# EasyEDA Pro project 单片机最小系统板.eprj

# Schematic Schematic1
Board Name: Board1; Create Date: 2024-09-29; Page Name: P1; Project Name: 单片机最小系统板; Schematic Name: Schematic1; Update Date: 2024-10-05; Company: 嘉立创EDA; Page Size: A4; Version: V1.0
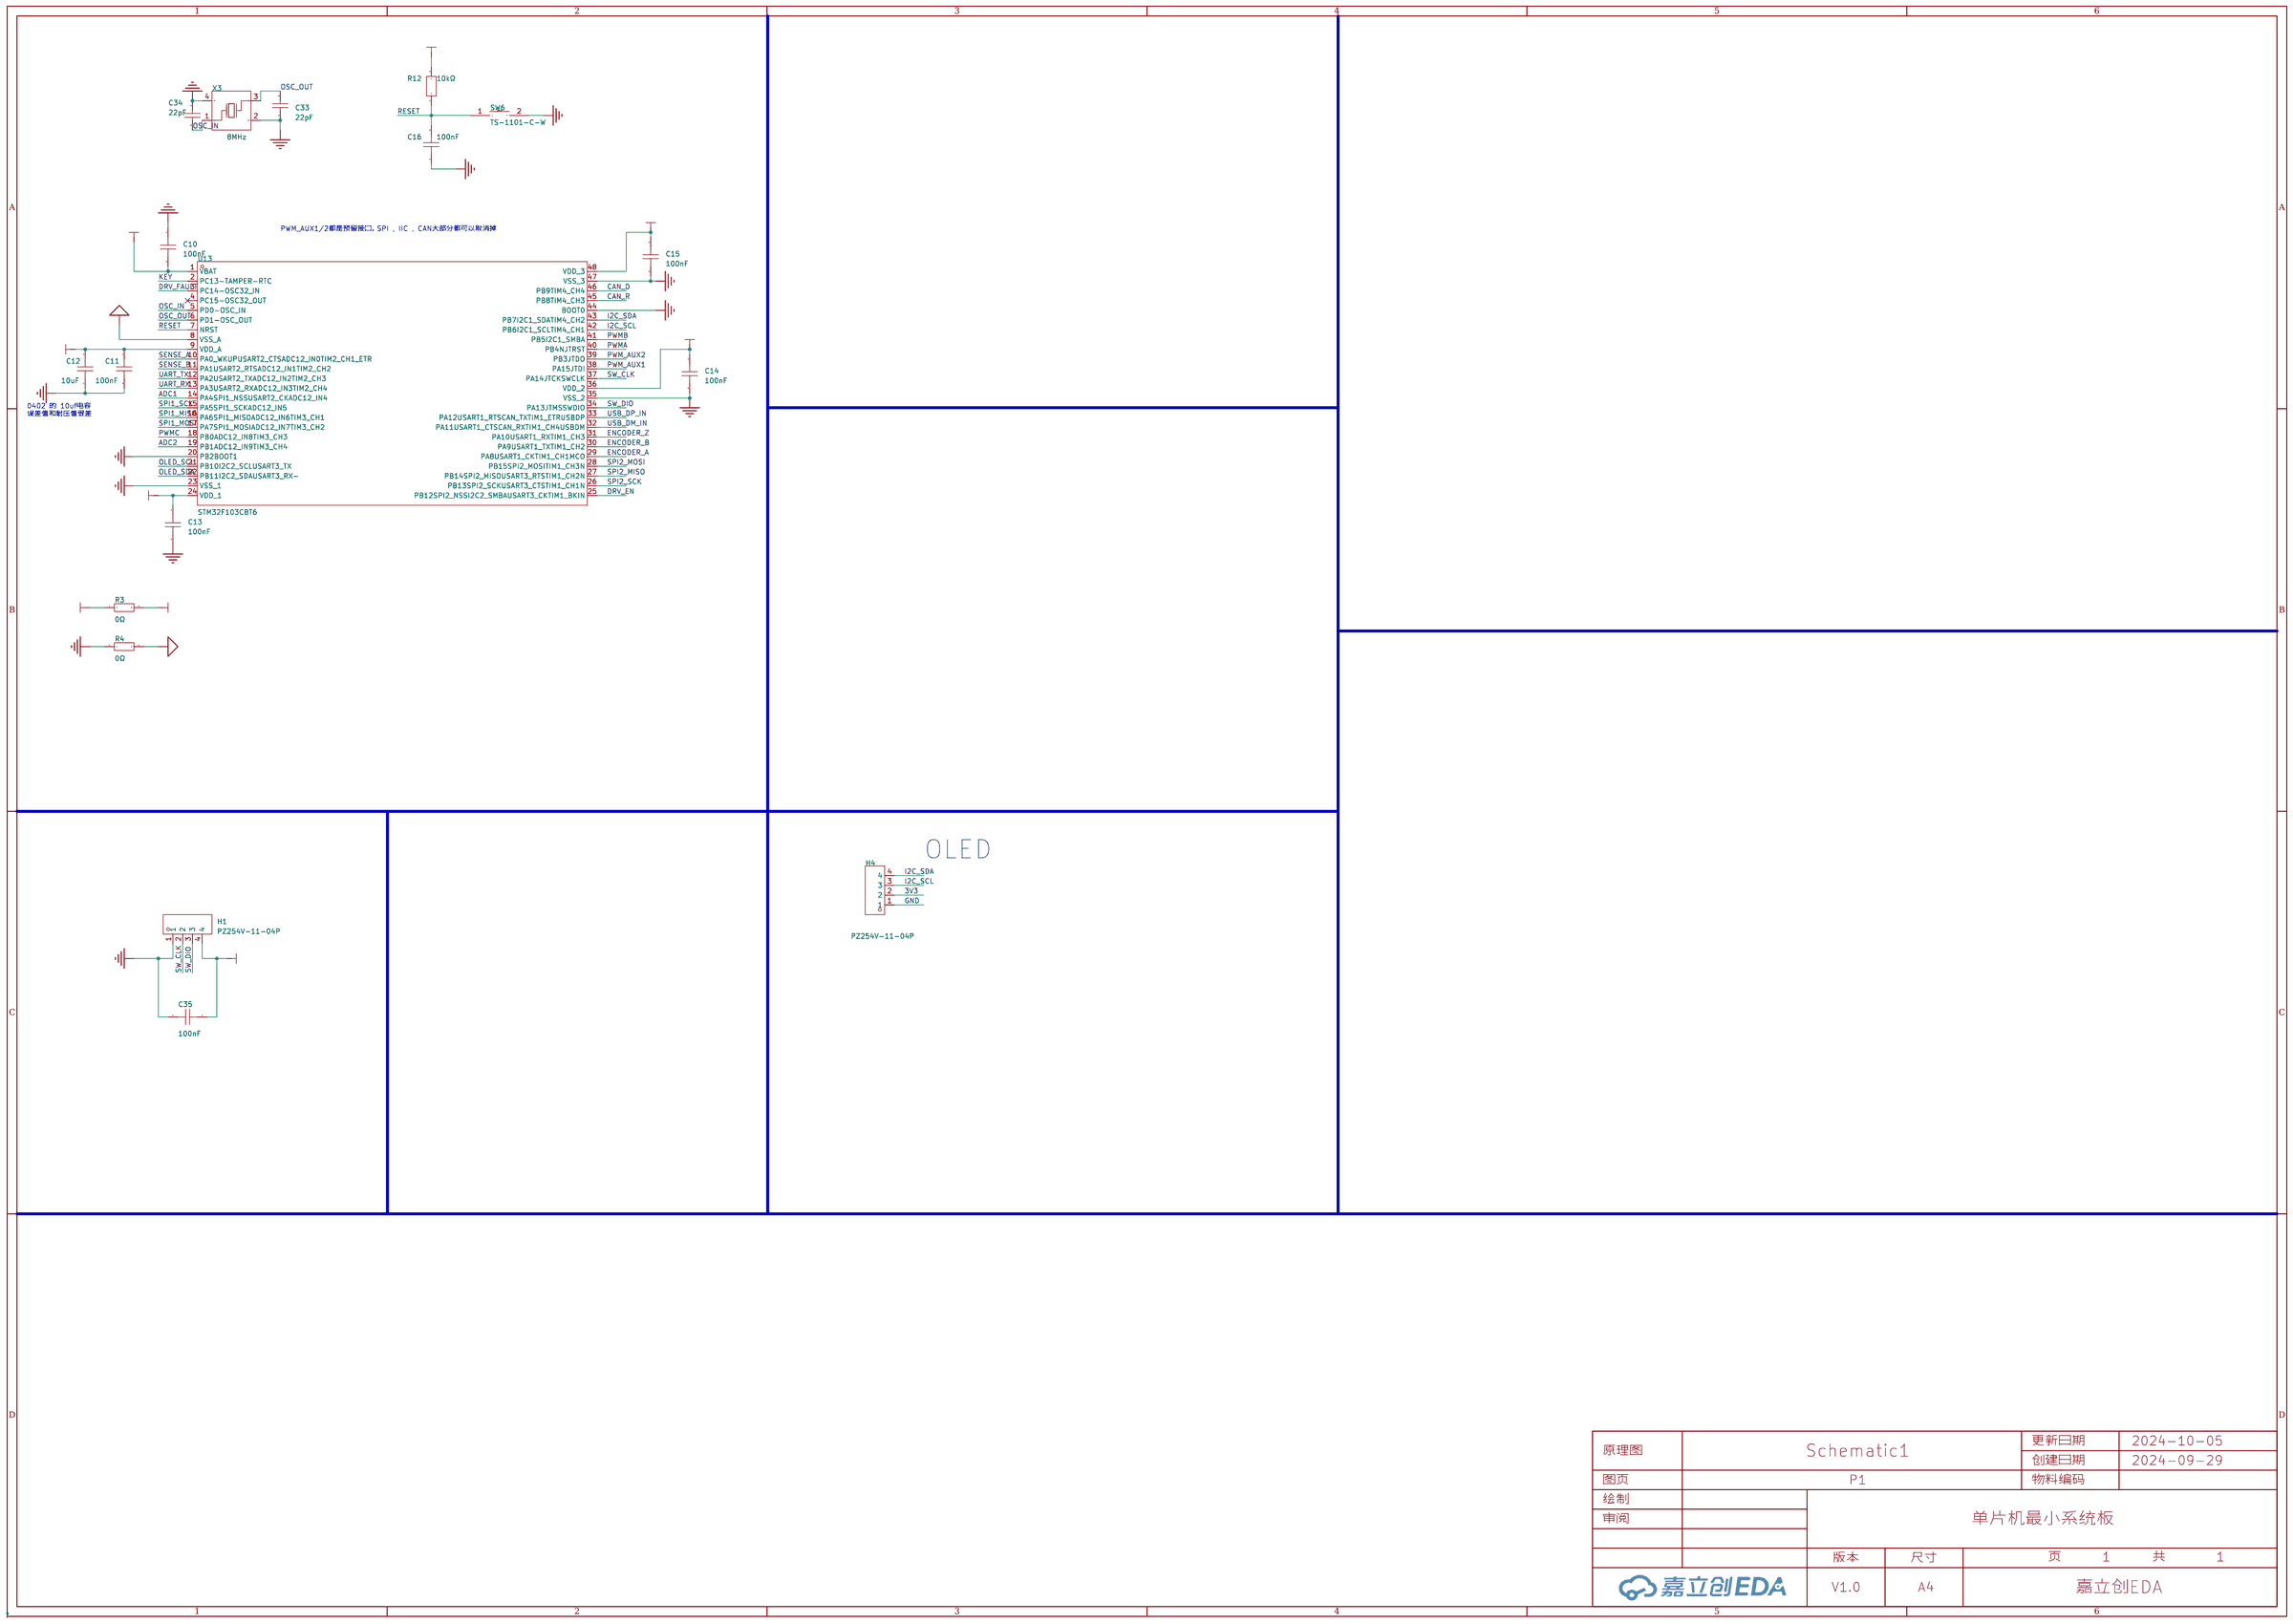
[diagram p0: schematic sheet]

## Parts
C10  100nF  [C0603]
C11  100nF  [C0603]
C12  10uF  [C0603]
C13  100nF  [C0603]
C14  100nF  [C0603]
C15  100nF  [C0603]
C16  100nF  [C0603]
C33  22pF  [C0603]
C34  22pF  [C0603]
C35  100nF  [C0603]
H1  PZ254V-11-04P  [HDR-TH_4P-P2.54-V-M]
H4  PZ254V-11-04P  [HDR-TH_4P-P2.54-V-M]
R3  0Ω  [R0603]
R4  0Ω  [R0603]
R12  10kΩ  [R0603]
SW6  TS-1101-C-W  [SW-SMD_L6.0-W3.3-LS8.0]
U13  STM32F103CBT6  [LQFP-48_L7.0-W7.0-P0.50-LS9.0-BL]
X3  8MHz  [OSC-SMD_4P-L3.2-W2.5-BL]

## Library data of the parts
C10 C11 C13-C16 C35 = CGA0603X7R104K500JT: 容值:100nF;精度:±10%;额定电压:50V;材质(温度系数):X7R;; LCSC Part Name: 100nF ±10% 50V; Supplier Part: C6119867; Manufacturer: HRE(芯声); Supplier Footprint: 0603; JLCPCB Part Class: 扩展库; Supplier: LCSC; Tolerance: ±10%; Voltage Rated: 50V; Temperature Coefficient: X7R
C12 = GRM188R6YA106MA73D: 容值:10uF;精度:±20%;额定电压:35V;材质(温度系数):X5R;; LCSC Part Name: 10uF ±20% 35V; Supplier Part: C194427; Manufacturer: muRata(村田); Supplier Footprint: 0603; JLCPCB Part Class: 扩展库; Datasheet: https://atta.szlcsc.com/upload/public/pdf/source/20210128/C194427_FCA3640823207DDB58700A82F1A19B5F.pdf; Supplier: LCSC; Tolerance: ±20%; Voltage Rated: 35V; Temperature Coefficient: X5R
C33 C34 = CL10C220JB8NNNC: 容值:22pF;精度:±5%;额定电压:50V;材质(温度系数):C0G;; LCSC Part Name: 22pF ±5% 50V; Supplier Part: C1653; Manufacturer: SAMSUNG(三星); Supplier Footprint: 0603; JLCPCB Part Class: 基础库; Datasheet: https://atta.szlcsc.com/upload/public/pdf/source/20160218/1457707763339.pdf; Supplier: LCSC; Tolerance: ±5%; Voltage Rated: 50V; Temperature Coefficient: C0G
H1 H4 = PZ254V-11-04P: 插针结构:1x4P;间距:2.54mm;行距:-;圆针/方针:方针;安装类型:直插;排数:单排;总PIN位数:4P;额定电流:3A;额定电压:250V;配合针长度:6mm;塑高:2.5mm;端接针长度:3mm;触头材质:-;工作温度范围:-40℃~+105℃;颜色:黑色;; LCSC Part Name: 间距:2.54mm 1x4P 直插 方针; Supplier Part: C2691448; Manufacturer: XFCN(兴飞); Supplier Footprint: 插件,P=2.54mm; JLCPCB Part Class: 扩展库; Datasheet: https://atta.szlcsc.com/upload/public/pdf/source/20200309/C492403_F9F19131791D08044AD4F84F8E751A34.pdf; Supplier: LCSC; Pin Structure: 1x4P; Pitch: 2.54mm; Circluar Pins/Square Pins: 方针; Mounting Type: 直插; Number of Rows: 单排; Number of Pins: 4P; Current Rating (Max): 3A; Voltage Rating (Max): 250V; Length of Mating Pin: 6mm; Insulation Height: 2.5mm; Length of End Connection Pin: 3mm; Operating Temperature Range: -40℃~+105℃; Color: 黑色
R3 R4 = 0603WAF0000T5E: 电阻类型:厚膜电阻;阻值:0Ω;精度:±1%;功率:100mW;最大工作电压:75V;; LCSC Part Name: 0Ω ±1% 100mW 厚膜电阻; Supplier Part: C21189; Manufacturer: UNI-ROYAL(厚声); Supplier Footprint: 0603; JLCPCB Part Class: 基础库; Datasheet: https://atta.szlcsc.com/upload/public/pdf/source/20200306/C422600_1E6D84923E4A46A82E41ADD87F860B5C.pdf; Supplier: LCSC; Type: 厚膜电阻; Tolerance: ±1%; Power(Watts): 100mW; Overload Voltage (Max): 75V; Operating Temperature Range: -55℃~+155℃
R12 = FRC0603J103TS: 电阻类型:厚膜电阻;阻值:10kΩ;精度:±5%;功率:100mW;最大工作电压:75V;温度系数:±100ppm/℃;; LCSC Part Name: 10kΩ ±5% 100mW 厚膜电阻; Supplier Part: C2930027; Manufacturer: FOJAN(富捷); Supplier Footprint: 0603; JLCPCB Part Class: 扩展库; Datasheet: https://atta.szlcsc.com/upload/public/pdf/source/20211221/925EC7D7225764EE0046F22065062C87.pdf; Supplier: LCSC; Type: 厚膜电阻; Tolerance: ±5%; Power(Watts): 100mW; Overload Voltage (Max): 75V; Temperature Coefficient: ±100ppm/℃; Operating Temperature Range: -55℃~+155℃
SW6 = TS-1101-C-W: 电路结构:单刀单掷;按钮形状:矩形按钮;作用力:260gf;安装方式:立贴;开关长度:6mm;开关宽度:3.6mm;开关高度:2.5mm;带支架:不带;触点电流:50mA;额定电压(AC):-;额定电压(DC):12V;额定功率:-;绝缘电阻:-;带灯:无;机械寿命:5万次;; LCSC Part Name: 6*3.6*2.5mm 立贴 轻触开关; Supplier Part: C318938; Manufacturer: XKB Connectivity(中国星坤); Supplier Footprint: SMD; JLCPCB Part Class: 扩展库; Datasheet: https://atta.szlcsc.com/upload/public/pdf/source/20200227/C318938_C2E53B1EEDE37D980A33616AC086DE53.pdf; Supplier: LCSC; Circuit: 单刀单掷; Actuator Style: 矩形按钮; Operating Force: 260gf; Mounting Style: 立贴; Switch Length: 6mm; Switch Width: 3.6mm; Switch Height: 2.5mm; Strike Gundam: 不带; Contact Current: 50mA; Voltage Rating (DC): 12V; Actuator/Cap Color: 白色带淡绿; With Lamp: 无; Mechanical Life: 5万次; Operating Temperature: -30℃~+85℃
U13 = STM32F103CBT6: CPU内核:ARM-M3;程序存储容量:128KB;RAM总容量:20KB;GPIO端口数量:37;工作电压范围:2V~3.6V;CPU最大主频:72MHz;程序存储器类型:FLASH;; LCSC Part Name: 主流增强型ARM Cortex-M3 MCU，具有128 KB Flash、72 MHz CPU、电机控制、USB和CAN; Supplier Part: C8304; Manufacturer: ST(意法半导体); Supplier Footprint: LQFP-48(7x7); JLCPCB Part Class: 扩展库; Datasheet: https://atta.szlcsc.com/upload/public/pdf/source/20150811/1457707344439.pdf; Supplier: LCSC; CPU Core: ARM-M3; Program Storage Size: 128KB; RAM Size: 20KB; GPIO Ports Number: 37; Operating Voltage Range: 2V~3.6V; CPU Maximum Speed: 72MHz; Program Memory Type: FLASH; Operating Temperature Range: -40℃~+85℃; ADC (Bit): 12bit; Universal Serial Bus: 有; Peripheral/Function: DMA；温度传感器；PWM; Watchdog: 有; Infrared Data Association: 有; Low-Voltage Detect: 有; Direct Memory Access: 有; Internal Oscillator: 有
X3 = TAXM8M4RFDCET2T: 晶振类型:贴片晶振;频率:8MHz;常温频差:±20ppm;外接负载电容:12pF;频率稳定度(全温):±20ppm;; LCSC Part Name: 8MHz ±20ppm 12pF; Supplier Part: C403948; Manufacturer: YJX(雅晶鑫); Supplier Footprint: SMD3225-4P; JLCPCB Part Class: 扩展库; Datasheet: https://atta.szlcsc.com/upload/public/pdf/source/20190712/C403948_DCE244DEF035C9ADCC7C08191B17B6F0.pdf; Supplier: LCSC; Crystal Type: 贴片晶振; Normal temperature Frequency Tolerance: ±20ppm; External load capacitor: 12pF; Frequency Stability(Full temperature range): ±20ppm; Equivalent Series Resistance (ESR): 250Ω; Operating Temperature: -40℃~+85℃

## Nets
3V3: C10.2 C13.1 C14.1 C15.1 C35.2 H1.4 H4.2 R3.1 R12.2 U13.1(VBAT) U13.24(VDD_1) U13.36(VDD_2) U13.48(VDD_3)
AGND: R4.2 U13.8(VSS_A)
AVCC: C11.1 C12.2 R3.2 U13.9(VDD_A)
GND: C10.1 C11.2 C12.1 C13.2 C14.2 C15.2 C16.1 C33.1 C34.1 C35.1 H1.1 H4.1 R4.1 SW6.2 U13.20(PB2BOOT1) U13.23(VSS_1) U13.35(VSS_2) U13.44(BOOT0) U13.47(VSS_3) X3.2(GND) X3.4(GND)
ADC1: U13.14(PA4SPI1_NSSUSART2_CKADC12_IN4)
ADC2: U13.19(PB1ADC12_IN9TIM3_CH4)
CAN_D: U13.46(PB9TIM4_CH4)
CAN_R: U13.45(PB8TIM4_CH3)
DRV_EN: U13.25(PB12SPI2_NSSI2C2_SMBAUSART3_CKTIM1_BKIN)
DRV_FAULT: U13.3(PC14-OSC32_IN)
ENCODER_A: U13.29(PA8USART1_CKTIM1_CH1MCO)
ENCODER_B: U13.30(PA9USART1_TXTIM1_CH2)
ENCODER_Z: U13.31(PA10USART1_RXTIM1_CH3)
I2C_SCL: H4.3 U13.42(PB6I2C1_SCLTIM4_CH1)
I2C_SDA: H4.4 U13.43(PB7I2C1_SDATIM4_CH2)
KEY: U13.2(PC13-TAMPER-RTC)
OLED_SCL: U13.21(PB10I2C2_SCLUSART3_TX)
OLED_SDA: U13.22(PB11I2C2_SDAUSART3_RX-)
OSC_IN: C34.2 U13.5(PD0-OSC_IN) X3.1(OSC1)
OSC_OUT: C33.2 U13.6(PD1-OSC_OUT) X3.3(OSC2)
PWM_AUX1: U13.38(PA15JTDI)
PWM_AUX2: U13.39(PB3JTDO)
PWMA: U13.40(PB4NJTRST)
PWMB: U13.41(PB5I2C1_SMBA)
PWMC: U13.18(PB0ADC12_IN8TIM3_CH3)
RESET: C16.2 R12.1 SW6.1 U13.7(NRST)
SENSE_A: U13.10(PA0_WKUPUSART2_CTSADC12_IN0TIM2_CH1_ETR)
SENSE_B: U13.11(PA1USART2_RTSADC12_IN1TIM2_CH2)
SPI1_MISO: U13.16(PA6SPI1_MISOADC12_IN6TIM3_CH1)
SPI1_MOSI: U13.17(PA7SPI1_MOSIADC12_IN7TIM3_CH2)
SPI1_SCK: U13.15(PA5SPI1_SCKADC12_IN5)
SPI2_MISO: U13.27(PB14SPI2_MISOUSART3_RTSTIM1_CH2N)
SPI2_MOSI: U13.28(PB15SPI2_MOSITIM1_CH3N)
SPI2_SCK: U13.26(PB13SPI2_SCKUSART3_CTSTIM1_CH1N)
SW_CLK: H1.2 U13.37(PA14JTCKSWCLK)
SW_DIO: H1.3 U13.34(PA13JTMSSWDIO)
UART_RX: U13.13(PA3USART2_RXADC12_IN3TIM2_CH4)
UART_TX: U13.12(PA2USART2_TXADC12_IN2TIM2_CH3)
USB_DM_IN: U13.32(PA11USART1_CTSCAN_RXTIM1_CH4USBDM)
USB_DP_IN: U13.33(PA12USART1_RTSCAN_TXTIM1_ETRUSBDP)

Not connected (* = marked no-connect by the designer): U13 4(PC15-OSC32_OUT)*

## Notes on the sheet
- PWM_AUX1/2都是预留接口，SPI , IIC , CAN大部分都可以取消掉
- 0402 的 10uf电容
  误差值和耐压值很差
- OLED

# Board PCB1
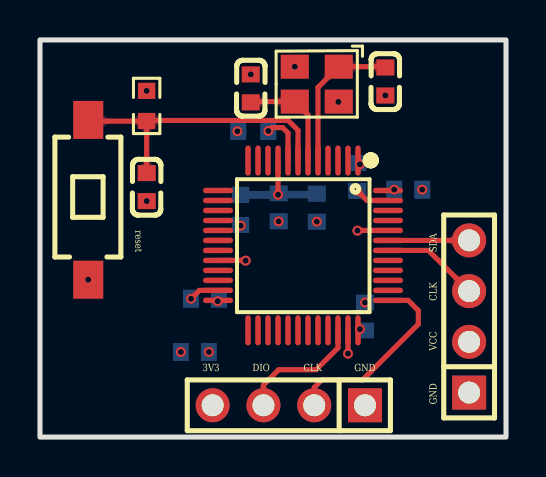
[diagram p1: board, top side]
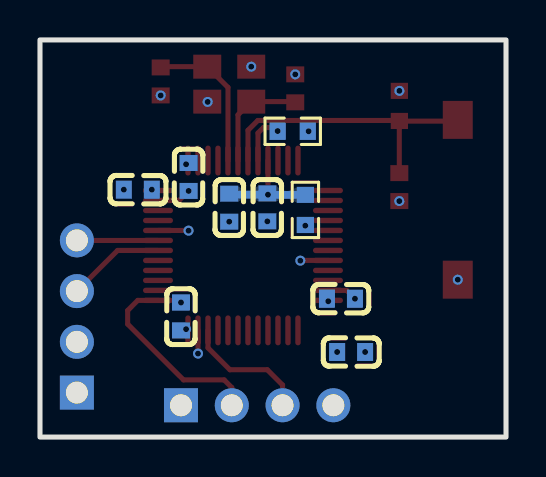
[diagram p2: board, bottom side, seen from below]

Outline 23.31 x 19.88 mm; copper layers: Top Layer, 3V3, GND, Bottom Layer. Coordinates in mm from the lower left corner of the outline.
Outline path: rectangle 0,19.88 23.31,0
Stack: Top Layer 0.035mm 外层铜厚1oz / Dielectric1 0.2104mm 7628 RC49% 8.6mil / 3V3 0.0152mm 内层铜厚 / Dielectric2 1.065mm 1.1mm H/HOZ 含铜 / GND 0.0152mm 内层铜厚 / Dielectric3 0.2104mm 7628 RC49% 8.6mil / Bottom Layer 0.035mm 外层铜厚1oz

## Design rules (mm)
template: 自定义配置
spacing copperThickness1oz (default): track to track 0.102, other pairs 0.152 to 0.3
spacing copperThickness2oz: track to track 0.203, other pairs 0.152 to 0.3
track width copperThickness1oz (default): min 0.127, default 0.254, max 2.54
track width copperThickness2oz: min 0.203, default 0.254, max 2.54
differential pair differentialPair (default): width min 0.127, default 0.254, max 2.54; gap min 0.152, default 0.152
via viaSize (default): diameter min 0.5, default 0.503, max 10; hole min 0.3, default 0.302, max 6.3

## Placement (name value [footprint] x y rotation side)
C10  100nF  [C0603]  15.88 13.02 90 bottom
C11  100nF  [C0603]  13.84 11.48 270 bottom
C12  10uF  [C0603]  11.94 11.5 90 bottom
C13  100nF  [C0603]  8.25 6.93 180 bottom
C14  100nF  [C0603]  16.26 6.04 90 bottom
C15  100nF  [C0603]  18.41 12.39 0 bottom
C16  100nF  [C0603]  5.34 12.51 90 top
C33  22pF  [C0603]  10.54 17.46 270 top
C34  22pF  [C0603]  17.27 17.8 90 top
C35  100nF  [C0603]  7.75 4.26 0 bottom
H1  PZ254V-11-04P  [HDR-TH_4P-P2.54-V-M]  12.45 1.59 180 top
H4  PZ254V-11-04P  [HDR-TH_4P-P2.54-V-M]  21.46 6.04 90 top
R3  0Ω  [R0603]  10.03 11.37 90 bottom
R4  0Ω  [R0603]  10.67 15.31 0 bottom
R12  10kΩ  [R0603]  5.33 16.58 90 top
SW6  TS-1101-C-W  [SW-SMD_L6.0-W3.3-LS8.0]  2.41 11.88 270 top
U13  STM32F103CBT6  [LQFP-48_L7.0-W7.0-P0.50-LS9.0-BL]  13.16 9.59 180 top
X3  8MHz  [OSC-SMD_4P-L3.2-W2.5-BL]  13.84 17.67 180 top

## Footprints (pads in the part's own frame, mm; a bottom-side part is the same pattern mirrored in y, then rotated)
C0603
  rect 0.8x0.9 smd: 1(-0.7,0) 2(0.7,0)
HDR-TH_4P-P2.54-V-M
  rect 1.7x1.7 hole 1.1: 1(-3.81,0)
  round 1.7 hole 1.1: 2(-1.27,0) 3(1.27,0) 4(3.81,0)
LQFP-48_L7.0-W7.0-P0.50-LS9.0-BL
  oval 0.27x1.5 smd: 1(-2.75,-4.25) 2(-2.25,-4.25) 3(-1.75,-4.25) 4(-1.25,-4.25) 5(-0.75,-4.25) 6(-0.25,-4.25) 7(0.25,-4.25) 8(0.75,-4.25) 9(1.25,-4.25) 10(1.75,-4.25) 11(2.25,-4.25) 12(2.75,-4.25) 25(2.75,4.25) 26(2.25,4.25) 27(1.75,4.25) 28(1.25,4.25) 29(0.75,4.25) 30(0.25,4.25) 31(-0.25,4.25) 32(-0.75,4.25) 33(-1.25,4.25) 34(-1.75,4.25) 35(-2.25,4.25) 36(-2.75,4.25)
  oval 1.5x0.27 smd: 13(4.25,-2.75) 14(4.25,-2.25) 15(4.25,-1.75) 16(4.25,-1.25) 17(4.25,-0.75) 18(4.25,-0.25) 19(4.25,0.25) 20(4.25,0.75) 21(4.25,1.25) 22(4.25,1.75) 23(4.25,2.25) 24(4.25,2.75) 37(-4.25,2.75) 38(-4.25,2.25) 39(-4.25,1.75) 40(-4.25,1.25) 41(-4.25,0.75) 42(-4.25,0.25) 43(-4.25,-0.25) 44(-4.25,-0.75) 45(-4.25,-1.25) 46(-4.25,-1.75) 47(-4.25,-2.25) 48(-4.25,-2.75)
OSC-SMD_4P-L3.2-W2.5-BL
  rect 1.4x1.2 smd: 1(-1.1,-0.875) 2(1.1,-0.875) 3(1.1,0.875) 4(-1.1,0.875)
R0603
  rect 0.806x0.864 smd: 1(-0.753,0) 2(0.753,0)
SW-SMD_L6.0-W3.3-LS8.0
  rect 1.9x1.5 smd: 1(-4,0) 2(4,0)

## Nets
As in the schematic.

Pads without a net: U13 4

## Via types
v1: diameter 0.5, hole 0.3, Top Layer to Bottom Layer, 24 vias
v2: diameter 0.503, hole 0.302, Top Layer to Bottom Layer, 2 vias

## Routing (per net, layer and track width the routed paths; a pad name or vN(x,y) marks a point on that pad's centre or on a via; arc(x,y) is an arc through that point)
3V3:
  vias: v1(5.33,17.33) v1(8.89,6.8) v1(10.04,10.58) v1(16,13.66) v1(16,5.4) v1(17.72,12.39) v2(8.45,4.26)
AGND: length 2.5
  Top Layer w0.254: v1(11.42,15.32) 11.6,15.49 12.13,15.49 12.41,15.22 U13.8
AVCC: length 5.6
  Top Layer w0.254: U13.9 v1(11.91,12.13)
  Bottom Layer w0.381: v1(11.91,12.13) 13.79,12.13 C11.1 ; R3.2 11.86,12.12 C12.2
GND: length 7.3
  Top Layer w0.254: v1(10.29,8.83) 10.28,8.84 U13.20 ; U13.47 16.35,11.84 v1(15.88,12.32) ; U13.23 7.97,7.34 v1(7.56,6.93) ; v1(15.88,10.33) 15.89,10.34 U13.44 ; U13.35 v1(15.41,4.18)
  vias: v1(2.41,7.88) v1(5.34,11.81) v1(9.87,15.31) v1(10.54,18.16) v1(11.94,10.8) v1(12.74,18.54) v1(13.84,10.78) v1(14.92,16.78) v1(16.26,6.74) v1(17.27,17.1) v1(19.12,12.39) v2(7.05,4.26)
I2C_SCL: length 4.9
  Top Layer w0.254: U13.42 19.43,9.34 21.46,7.31
I2C_SDA: length 4.1
  Top Layer w0.254: H4.4 21.46,9.84 U13.43
OSC_IN: length 7.5
  Top Layer w0.254: C34.2 17.23,18.54 14.94,18.54 13.91,17.5 U13.5
OSC_OUT: length 5.4
  Top Layer w0.254: U13.6 13.41,16.13 X3.3 10.58,16.79 C33.2
RESET: length 14.9
  Top Layer w0.254: C16.2 5.34,15.81 5.34,15.82 2.48,15.82 SW6.1 ; U13.7 12.91,15.36 12.41,15.85 5.36,15.85 R12.1
SW_CLK: length 9.8
  Top Layer w0.254: H1.2 13.72,2.48 14.1,2.86 16.13,2.86 18.92,5.66 18.92,6.33 18.41,6.84 U13.37
SW_DIO: length 6.4
  Top Layer w0.254: H1.3 11.18,2.61 11.94,3.37 13.81,3.37 14.91,4.47 U13.34

## Copper pours and planes (outline as drawn; the poured copper is in the pictures)
3V3 on 3V3: 0.26,19.62 23.05,19.62 23.05,0.26 0.26,0.26
GND on GND: 0.26,19.62 23.05,19.62 23.05,0.26 0.26,0.26

Small or netless copper shapes (teardrops, artwork), in the pictures only: 35 on Top Layer, 6 on Bottom Layer, 8 on 3V3, 8 on GND

## Text on the board
Top Silkscreen Layer: 3V3 | DIO | CLK | GND | SDA | VCC | reset
